# EAGLE design power_v2 (EAGLE 9.6.1)
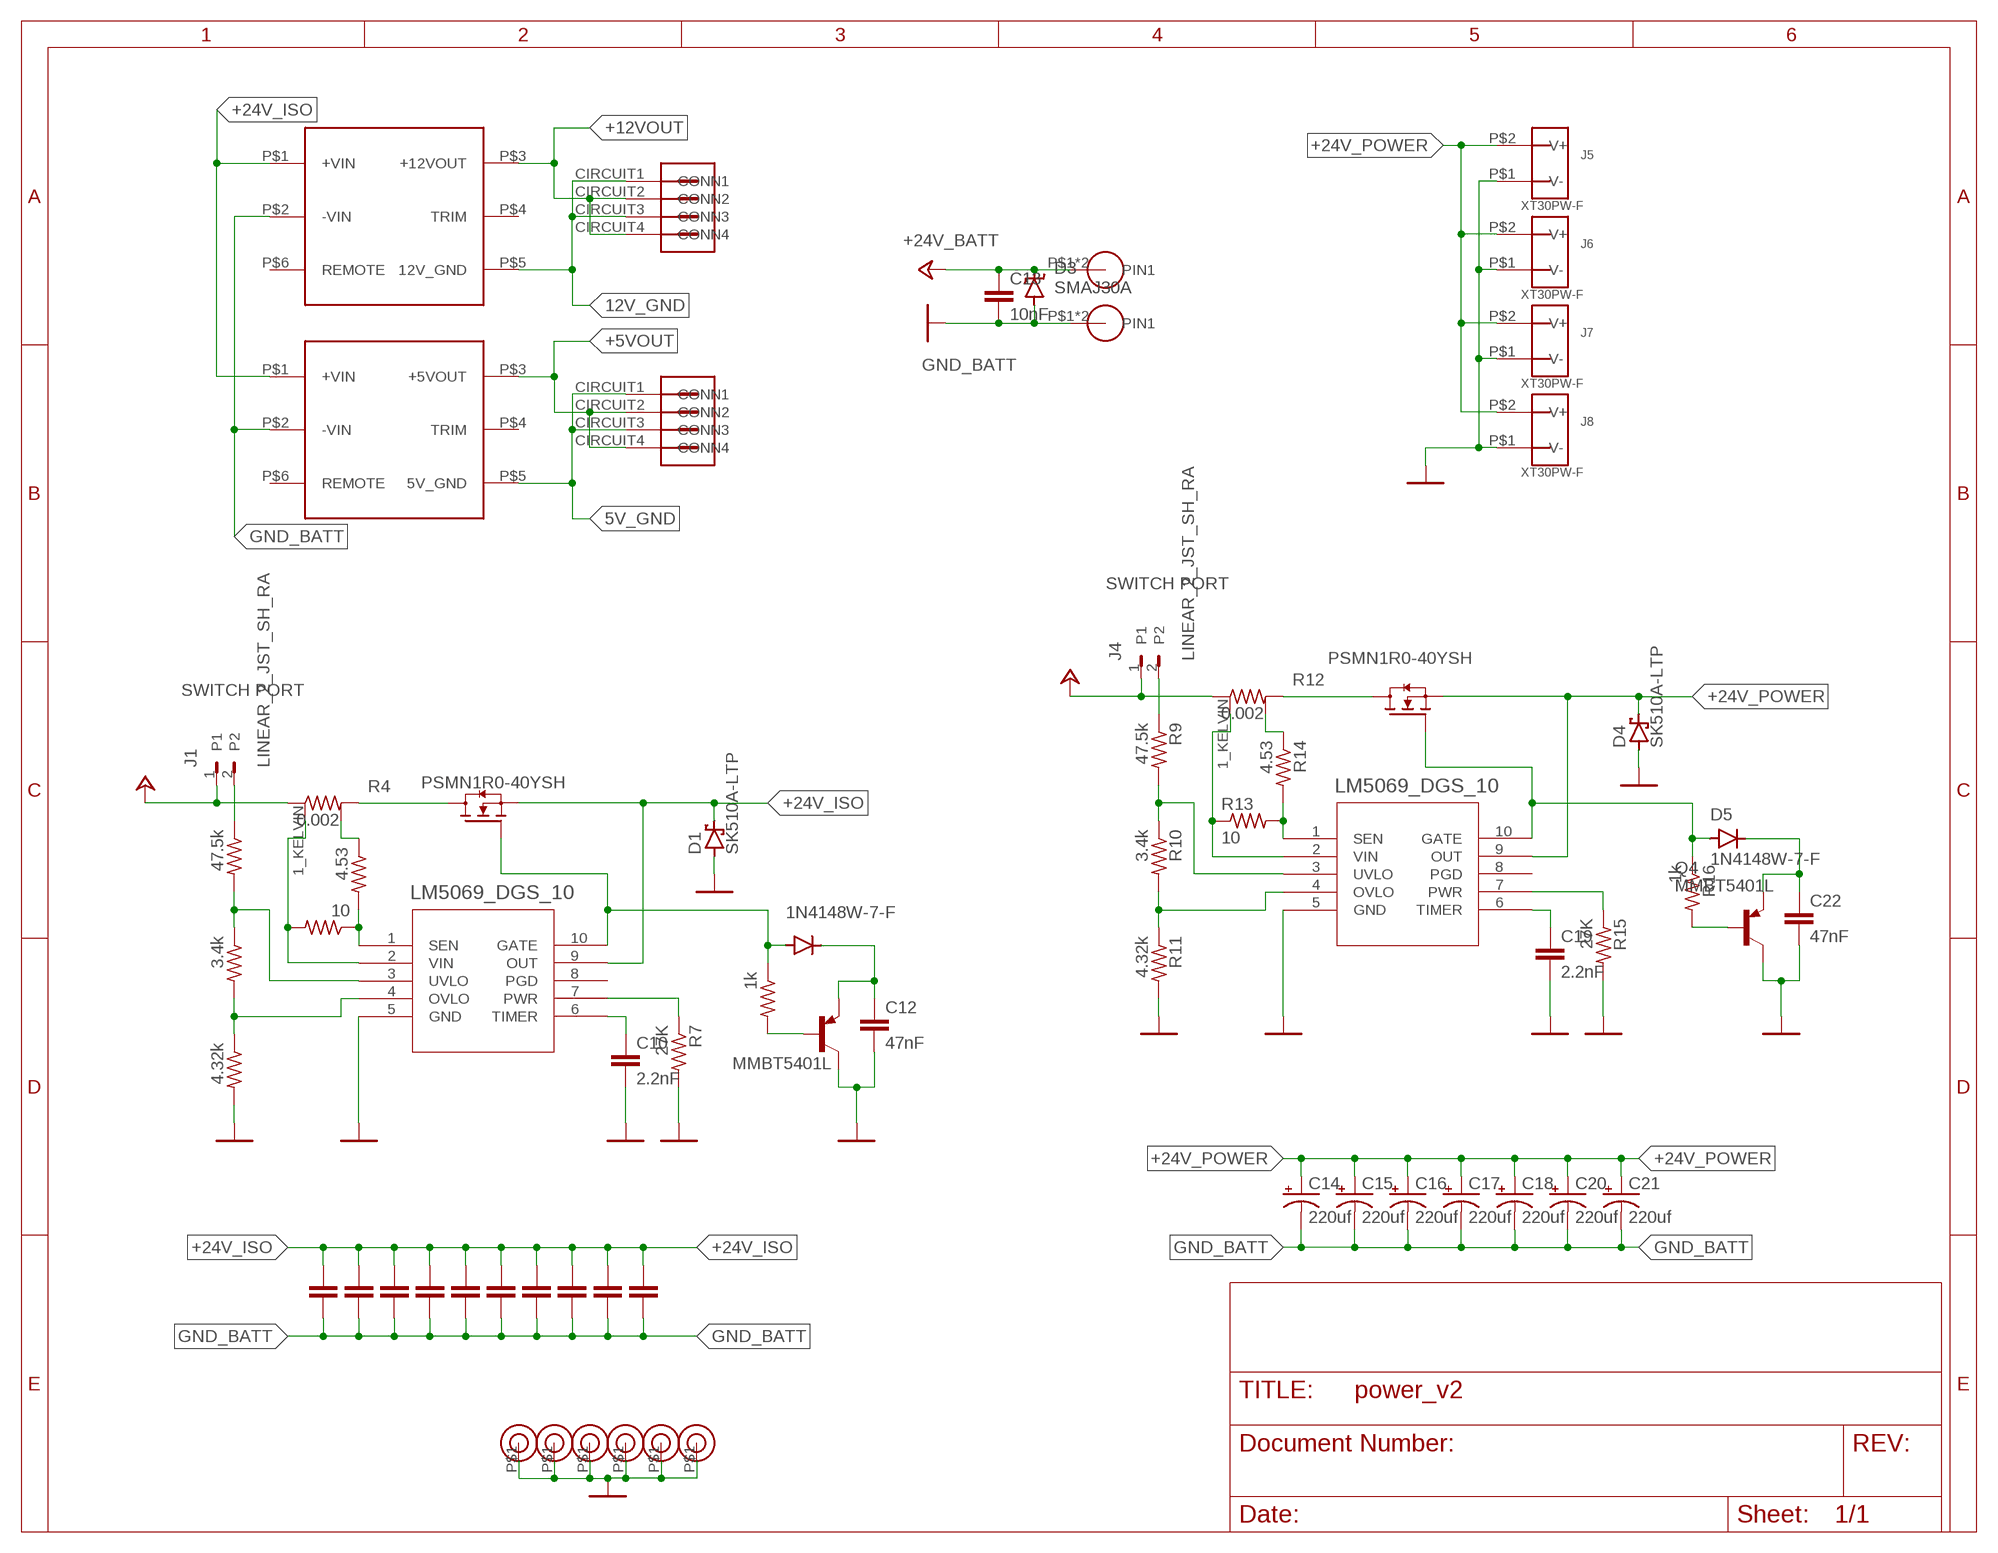
[diagram p0: schematic, sheet 1]

## Parts
C1  2.2nF  C_CERAMIC_1210  [C1210]
C2  10uF  C_CERAMIC_1210  [C1210]
C3  10uF  C_CERAMIC_1210  [C1210]
C4  10uF  C_CERAMIC_1210  [C1210]
C5  10uF  C_CERAMIC_1210  [C1210]
C6  10uF  C_CERAMIC_1210  [C1210]
C7  10uF  C_CERAMIC_1210  [C1210]
C8  10uF  C_CERAMIC_1210  [C1210]
C9  10uF  C_CERAMIC_1210  [C1210]
C10  2.2nF  C-EUC0603  [C0603]
C11  10uF  C_CERAMIC_1210  [C1210]
C12  47nF  C-EUC0603  [C0603]
C13  10nF  C-EUC0603  [C0603]
C14  220uf  35ZLH220MEFC8X11.5  [C_ELEC_8X11_5]
C15  220uf  35ZLH220MEFC8X11.5  [C_ELEC_8X11_5]
C16  220uf  35ZLH220MEFC8X11.5  [C_ELEC_8X11_5]
C17  220uf  35ZLH220MEFC8X11.5  [C_ELEC_8X11_5]
C18  220uf  35ZLH220MEFC8X11.5  [C_ELEC_8X11_5]
C19  2.2nF  C-EUC0603  [C0603]
C20  220uf  35ZLH220MEFC8X11.5  [C_ELEC_8X11_5]
C21  220uf  35ZLH220MEFC8X11.5  [C_ELEC_8X11_5]
C22  47nF  C-EUC0603  [C0603]
D1  SK510A-LTP  [DO-214AC]
D2  1N4148W-7-F  [SOD123]
D3  SMAJ30A  [DO-214AC]
D4  SK510A-LTP  [DO-214AC]
D5  1N4148W-7-F  [SOD123]
H1  GND_HOLE_M3  [HOLE_GND_M3]
H2  GND_HOLE_M3  [HOLE_GND_M3]
H3  GND_HOLE_M3  [HOLE_GND_M3]
H4  GND_HOLE_M3  [HOLE_GND_M3]
H5  GND_HOLE_M3  [HOLE_GND_M3]
H6  GND_HOLE_M3  [HOLE_GND_M3]
J1  LINEAR_2_JST_SH_RA  [JST_SM02B-SRSS-TB]
J2  12v  MOLEX_4_RA  [MOLEX_4_RA]
J3  5v  MOLEX_4_RA  [MOLEX_4_RA]
J4  LINEAR_2_JST_SH_RA  [JST_SM02B-SRSS-TB]
J5  XT30PW-F  [XT30PW-F]
J6  XT30PW-F  [XT30PW-F]
J7  XT30PW-F  [XT30PW-F]
J8  XT30PW-F  [XT30PW-F]
P1  FASTON1289_ST  [FASTON_1289-ST]
P2  FASTON1289_ST  [FASTON_1289-ST]
PS3  PDQ30-Q24-S12-D  [PDQ30-D]
PS4  PDQ30-Q24-S5-D  [PDQ30-D]
Q1  PSMN1R0-40YSH  [LFPAK56E]
Q2  MMBT5401L  [SOT23-3]
Q3  PSMN1R0-40YSH  [LFPAK56E]
Q4  MMBT5401L  [SOT23-3]
R1  47.5k  R-US_R0603  [R0603]
R2  3.4k  R-US_R0603  [R0603]
R3  4.32k  R-US_R0603  [R0603]
R4  0.002  PMR25HZPFV2L00  [R1210_KELVIN]
R5  10  R-US_R0603  [R0603]
R6  4.53  R-US_R0603  [R0603]
R7  27K  R-US_R0603  [R0603]
R8  1k  R-US_R0603  [R0603]
R9  47.5k  R-US_R0603  [R0603]
R10  3.4k  R-US_R0603  [R0603]
R11  4.32k  R-US_R0603  [R0603]
R12  0.002  PMR25HZPFV2L00  [R1210_KELVIN]
R13  10  R-US_R0603  [R0603]
R14  4.53  R-US_R0603  [R0603]
R15  27K  R-US_R0603  [R0603]
R16  1k  R-US_R0603  [R0603]
U1  LM5069_DGS_10  [VSSOP_DGS_10]
U2  LM5069_DGS_10  [VSSOP_DGS_10]

## Nets
5V_GND: J3.CIRCUIT1(CONN1) J3.CIRCUIT3(CONN3) PS4.P$5(5V_GND)
12V_GND: J2.CIRCUIT1(CONN1) J2.CIRCUIT3(CONN3) PS3.P$5(12V_GND)
+5VOUT: J3.CIRCUIT2(CONN2) J3.CIRCUIT4(CONN4) PS4.P$3(+5VOUT)
+12VOUT: J2.CIRCUIT2(CONN2) J2.CIRCUIT4(CONN4) PS3.P$3(+12VOUT)
+24V_BATT: C13.1 D3.C J1.1 J4.1 P1.P$1(PIN1) P1.P$2(PIN1) R4.1A R4.1B R12.1A R12.1B
+24V_ISO: C1.1 C2.1 C3.1 C4.1 C5.1 C6.1 C7.1 C8.1 C9.1 C11.1 D1.C PS3.P$1(+VIN) PS4.P$1(+VIN) Q1.1(S) Q1.2(S) Q1.3(S) U1.9(OUT)
+24V_POWER: C14.1(+) C15.1(+) C16.1(+) C17.1(+) C18.1(+) C20.1(+) C21.1(+) D4.C J5.P$2(V+) J6.P$2(V+) J7.P$2(V+) J8.P$2(V+) Q3.1(S) Q3.2(S) Q3.3(S) U2.9(OUT)
GND_BATT: C1.2 C2.2 C3.2 C4.2 C5.2 C6.2 C7.2 C8.2 C9.2 C10.2 C11.2 C12.2 C13.2 C14.2(-) C15.2(-) C16.2(-) C17.2(-) C18.2(-) C19.2 C20.2(-) C21.2(-) C22.2 D1.A D3.A D4.A H1.P$1(GND_HOLE) H2.P$1(GND_HOLE) H3.P$1(GND_HOLE) H4.P$1(GND_HOLE) H5.P$1(GND_HOLE) H6.P$1(GND_HOLE) J5.P$1(V-) J6.P$1(V-) J7.P$1(V-) J8.P$1(V-) P2.P$1(PIN1) P2.P$2(PIN1) PS3.P$2(-VIN) PS4.P$2(-VIN) Q2.C Q4.C R3.2 R7.2 R11.2 R15.2 U1.5(GND) U2.5(GND)
MOSFET_DRAIN: Q3.5(D) R12.2A R12.2B
MOSFET_DRAIN1: Q1.5(D) R4.2A R4.2B
N$1: R9.2 R10.1 U2.3(UVLO)
N$2: R10.2 R11.1 U2.4(OVLO)
N$3: J4.2 R9.1
N$4: R1.2 R2.1 U1.3(UVLO)
N$5: D5.A Q3.4(G) R16.1 U2.10(GATE)
N$6: R15.1 U2.7(PWR)
N$7: C19.1 U2.6(TIMER)
N$8: C22.1 D5.C Q4.E
N$9: Q4.B R16.2
N$10: R13.2 R14.2 U2.1(SEN)
N$11: R12.2_KELVIN(2K) R14.1
N$12: R2.2 R3.1 U1.4(OVLO)
N$13: J1.2 R1.1
N$14: D2.A Q1.4(G) R8.1 U1.10(GATE)
N$15: R7.1 U1.7(PWR)
N$16: C10.1 U1.6(TIMER)
N$17: C12.1 D2.C Q2.E
N$18: Q2.B R8.2
N$19: R12.1_KELVIN(1K) R13.1 U2.2(VIN)
N$20: R5.1 R6.2 U1.1(SEN)
N$21: R4.2_KELVIN(2K) R6.1
N$22: R4.1_KELVIN(1K) R5.2 U1.2(VIN)
Unconnected: J1.PAD1(GND) J1.PAD2(GND) J4.PAD1(GND) J4.PAD2(GND) PS3.P$4(TRIM) PS3.P$6(REMOTE) PS4.P$4(TRIM) PS4.P$6(REMOTE) U1.8(PGD) U2.8(PGD)

## Notes on the sheet
- SWITCH PORT
- SWITCH PORT

## Library data of the parts
C1-C9 C11 = timlib:C_CERAMIC
C10 C12 C13 C19 C22 = rcl:C-EU: CAPACITOR, European symbol; SPICEPREFIX: C
C14-C18 C20 C21 = timlib:35ZLH220MEFC8X11.5
D1 D4 = timlib:SK510A-LTP
D2 D5 = timlib:1N4148W-7-F
D3 = timlib:SMA: 12V Schottkey Datasheet <https://www.littelfuse.com/~/media/electronics/datasheets/tvs_diodes/littelfuse_tvs_diode_smaj_datasheet.pdf.pdf>
H1-H6 = timlib:GND_HOLE
J1 J4 = _T_conn:LINEAR_2
J2 J3 = timlib:MOLEX_4_RA: Molex 4 pin right angle 430450402 Datasheet <https://www.molex.com/pdm_docs/sd/430450402_sd.pdf>
J5-J8 = timlib:XT30PW-F
P1 P2 = timlib:FASTON
PS3 = timlib:PDQ30-Q24-S12-D: PDQ30-Q24-S12-D Isolated 12v DC-DC supply Datasheet <https://www.cui.com/product/resource/pdq30-d.pdf>
PS4 = timlib:PDQ30-Q24-S5-D: PDQ30-Q24-S5-D Isolated 5v DC-DC supply Datasheet <https://www.cui.com/product/resource/pdq30-d.pdf>
Q1 Q3 = timlib:PSMN1R0-40YSH: N-channel 40V 1mOhm 290A MOSFET Datasheet <https://assets.nexperia.com/documents/data-sheet/PSMN1R0-40YSH.pdf>
Q2 Q4 = timlib:MMBT5401L
R1-R3 R5-R11 R13-R16 = rcl:R-US_: RESISTOR, American symbol; SPICEPREFIX: R
R4 R12 = timlib:PMR25HZPFV
U1 U2 = timlib:LM5069_DGS_10

## Net classes
0 default: drill 0.3 mm
1 power plane: width 0.305 mm, clearance 0.5 mm

## Board
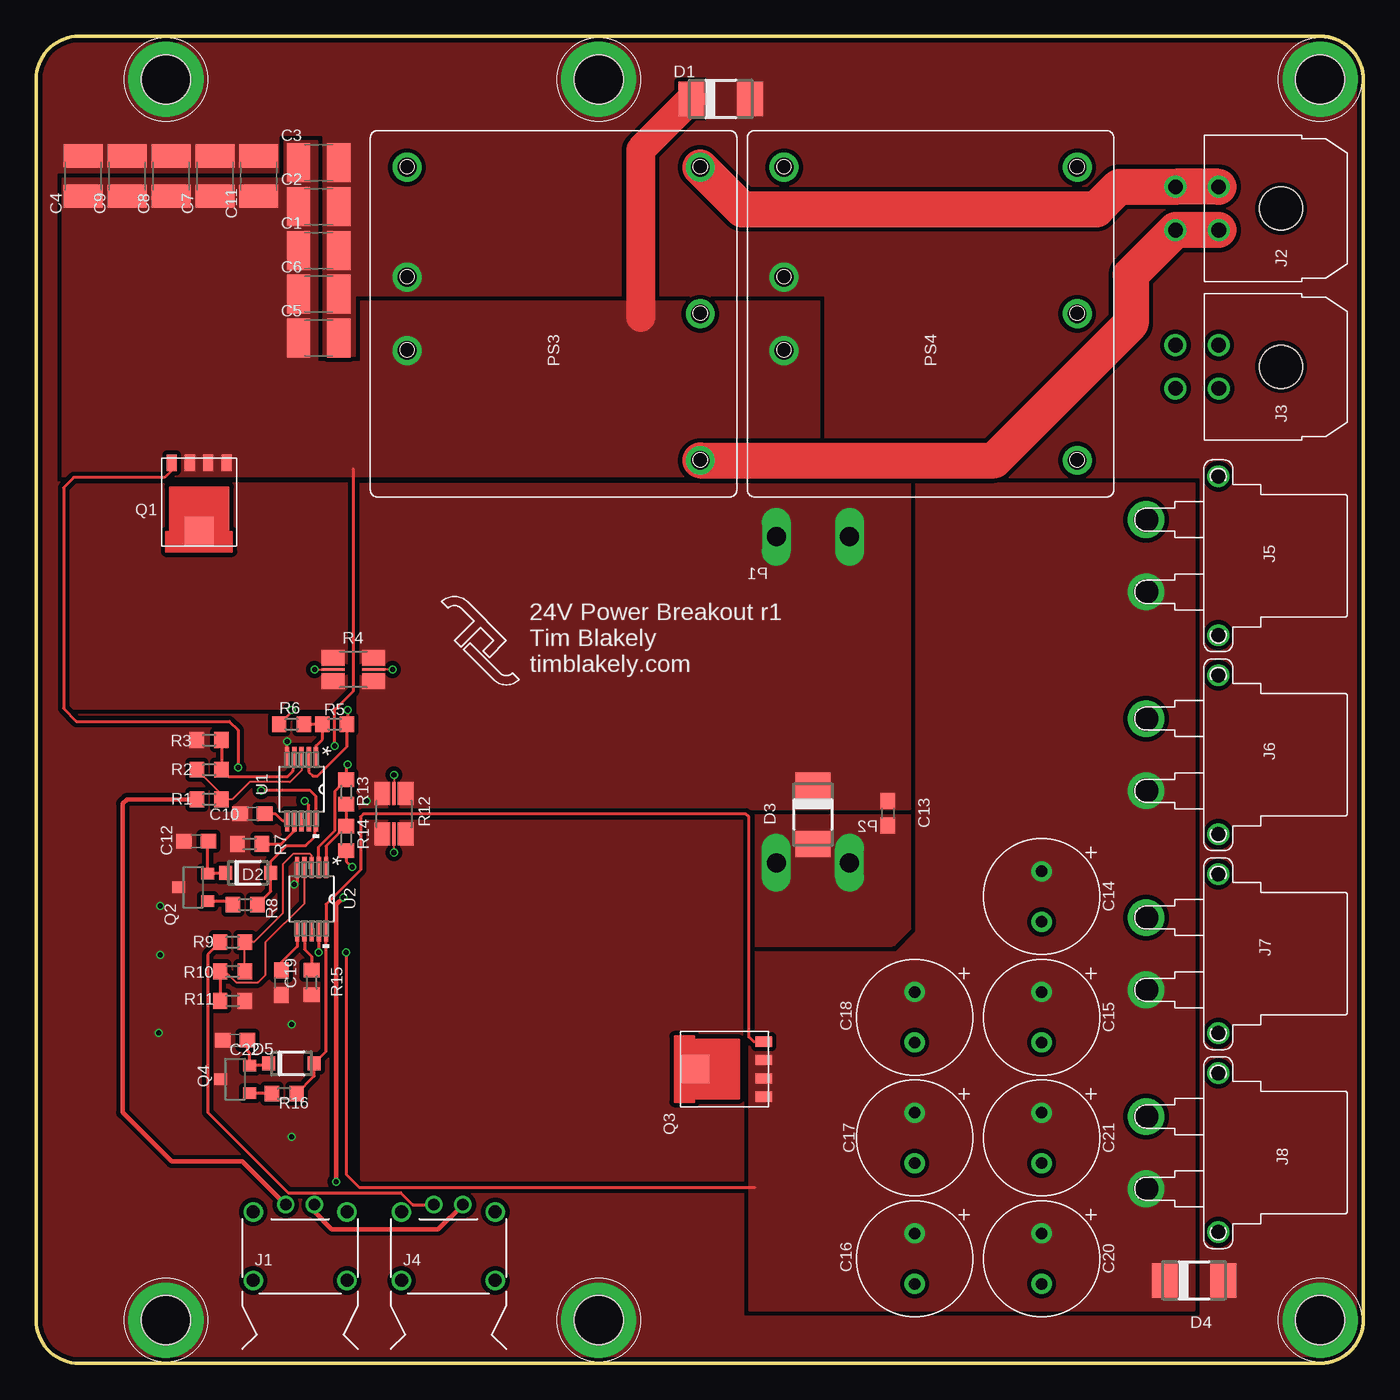
[diagram p1: board, top side]
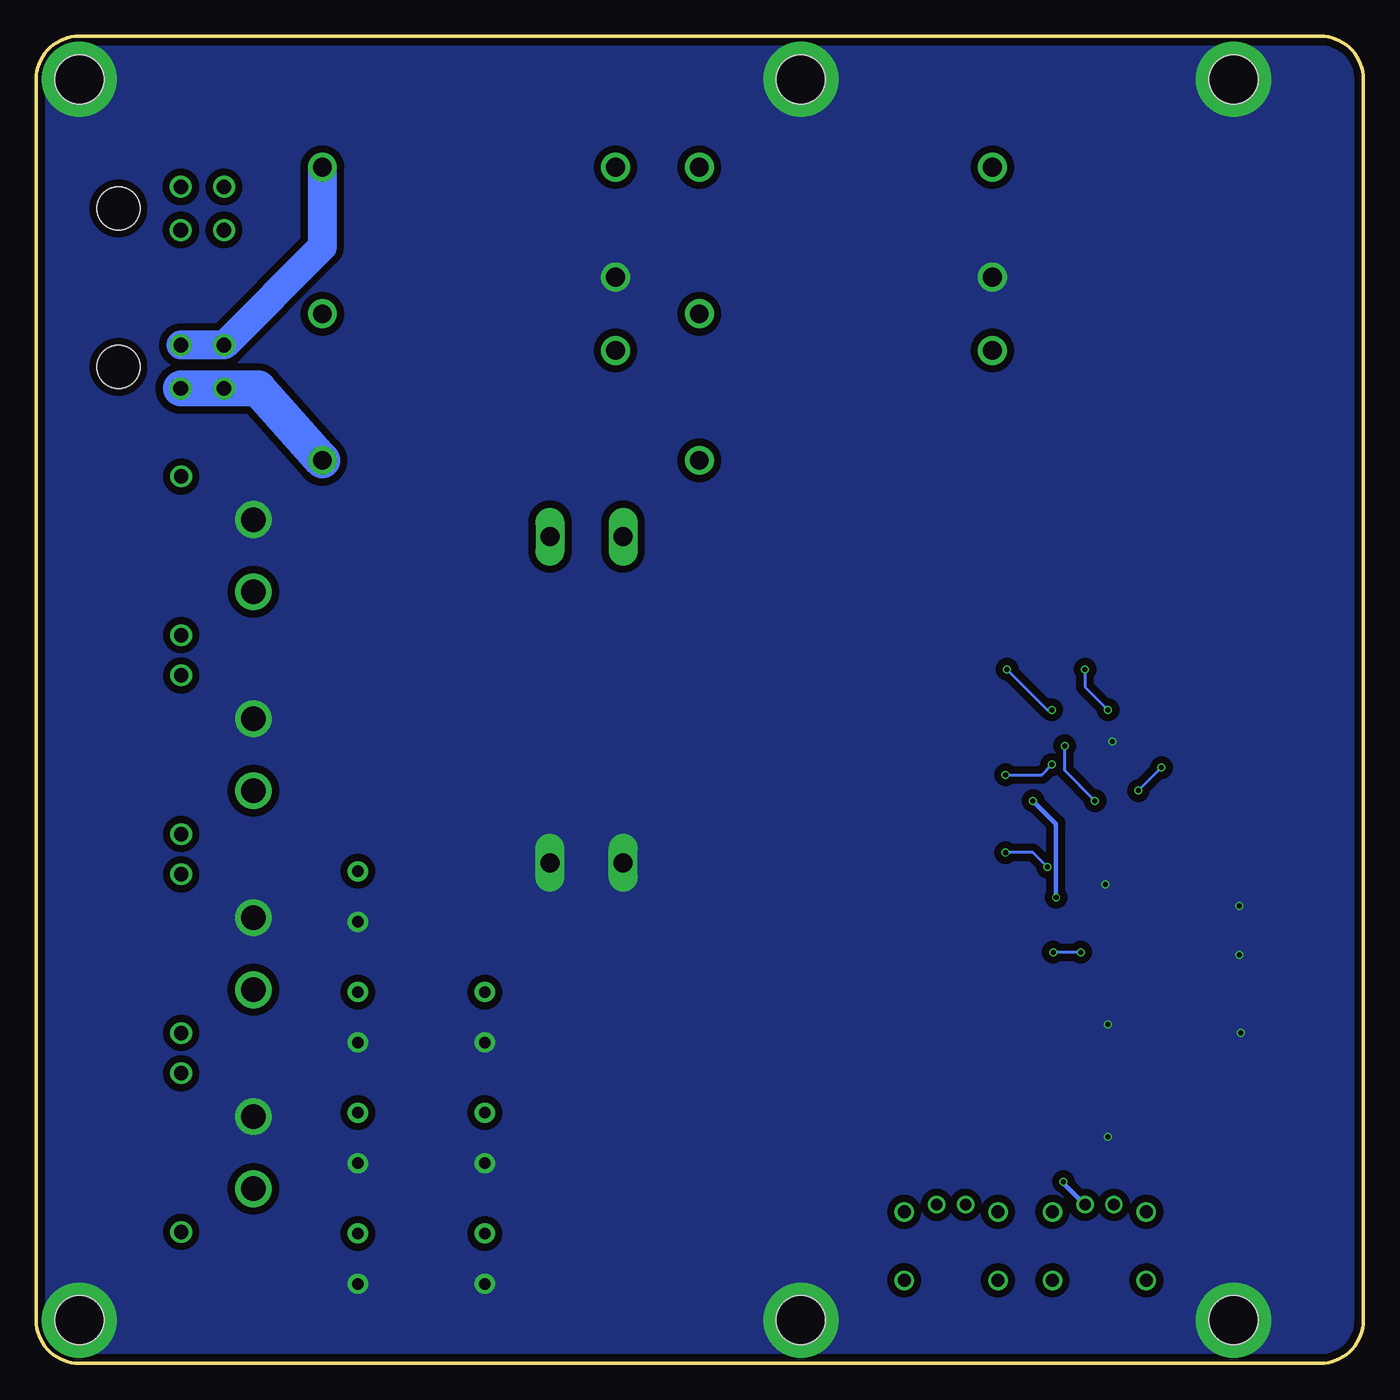
[diagram p2: board, bottom side, seen from below]

Size 92 x 92 mm. Coordinates in mm from the lower left corner, seen from the top.
Outline: 0,89 0,3 arc90 3,0 89,0 arc90 92,3 92,89 arc90 89,92 3,92 arc90 0,89
Copper layers (1*16): Top 0.035mm / dielectric 1.5mm / Bottom 0.035mm
Design rules "macrofab_2_layer": minimum track width 5mil, minimum drill 4mil, track to track 5mil, track to pad 5mil, pad to pad 5mil, via to via 5mil, smd to smd 0mil, copper to edge 10mil, drill to drill 10mil, minimum pad ring 4mil, minimum via ring 4mil, stop-mask expansion 2mil, vias tented up to drill 25mil, thermal gap 10mil
Holes 3.4 mm at 39,89 9,89 9,3 39,3 89,3 89,89

### Footprints (pad centres in the part's own frame; a part is rotated, then mirrored left to right if it is on the bottom)
C1210 = smd 1.6 x 2.7: 1 -1.4,0; 2 1.4,0
C0603 = smd 1.1 x 1: 1 -0.85,0; 2 0.85,0
C_ELEC_8X11_5 = drill 0.8 pad 1.4: 1 -1.75,0; 2 1.75,0
DO-214AC = smd 1.8 x 2.4: A 2.025,0; C -2.025,0
SOD123 = smd 0.9 x 0.95: A 1.575,0; C -1.575,0
HOLE_GND_M3 = drill 3.4 pad 5.2: P$1 0,0
M80-8420242 = drill 0.8: 1 1,0; 2 -1,0 | drill 0.9: P$4 3.25,-0.5; P$5 -3.25,-0.5; P$6 -3.25,-5.25; P$7 3.25,-5.25
MOLEX_4_RA = drill 1.016: CIRCUIT1 1.5,4.32; CIRCUIT2 -1.5,4.318; CIRCUIT3 1.5,7.32; CIRCUIT4 -1.5,7.32 | hole 3: 0,0
XT30PW-F = drill 1.7: P$1 -2.5,-5; P$2 2.5,-5 | drill 1: P$3 5.5,0; P$4 -5.5,0
FASTON_1289-ST = drill 1.32 pad 2 long: P$1 -2.54,0; P$2 2.54,0
PDQ30-D = drill 1.3 pad 2: P$1 -2.54,10.16; P$2 2.54,10.16; P$3 -10.16,-10.16; P$4 0,-10.16; P$5 10.16,-10.16; P$6 10.16,10.16
LFPAK56E = smd 0.7 x 1.15: 1 -1.905,-2.725; 2 -0.635,-2.725; 3 0.635,-2.725; 4 1.905,-2.725 | smd 2 x 2: 5 0,2.032
SOT23-3 = smd 0.8 x 0.9: B -0.95,-1; C 0,1; E 0.95,-1
R0603 = smd 1 x 1.1: 1 -0.85,0; 2 0.85,0
R1210_KELVIN = smd 1.6 x 0.229: 1_KELVIN -1.4,0; 2_KELVIN 1.4,0 | smd 1.6 x 1.1: 1A -1.4,0.8; 1B -1.4,-0.8; 2A 1.4,0.8; 2B 1.4,-0.8
VSSOP_DGS_10 = smd 1.45 x 0.3: 1 -2.2,1; 2 -2.2,0.5; 3 -2.2,0; 4 -2.2,-0.5; 5 -2.2,-1; 6 2.2,-1; 7 2.2,-0.5; 8 2.2,0; 9 2.2,0.5; 10 2.2,1

### Placement (x,y rotation side)
C1  19.59,77.14 0 top
C2  19.59,80.18 0 top
C3  19.59,83.22 0 top
C4  3.28,82.29 90 top
C5  19.59,71.06 0 top
C6  19.59,74.1 0 top
C7  12.4,82.29 90 top
C8  9.36,82.29 90 top
C9  6.32,82.29 90 top
C10  15,38.1 180 top
C11  15.44,82.29 90 top
C12  11.1,36.2 180 top
C13  59.03,38.15 270 top
C14  69.7,32.36 270 top
C15  69.7,23.99 270 top
C16  60.9,7.26 270 top
C17  60.9,15.63 270 top
C18  60.9,23.99 270 top
C19  17,26.4 270 top
C20  69.7,7.26 270 top
C21  69.7,15.63 270 top
C22  13.8,22.4 180 top
D1  47.45,87.64 0 top
D2  14.7,34 0 top
D3  53.85,38.05 270 top
D4  80.26,5.75 0 top
D5  17.7,20.8 0 top
H1  89,3 0 top
H2  39,3 0 top
H3  9,3 0 top
H4  9,89 0 top
H5  39,89 0 top
H6  89,89 0 top
J1  2-PIN  [M80-8420242]  18.3,11 0 top
J2  86.29,80.05 90 top
J3  86.29,69.08 90 top
J4  2-PIN  [M80-8420242]  28.58,11 0 top
J5  81.94,55.98 270 top
J6  81.94,42.19 270 top
J7  81.94,28.4 270 top
J8  81.94,14.61 270 top
P1  53.85,57.3 180 bottom
P2  53.85,34.7 0 bottom
PS3  35.87,72.75 90 top
PS4  62,72.75 90 top
Q1  11.3,59.7 180 top
Q2  10.9,33 90 top
Q3  47.7,20.4 90 top
Q4  13.8,19.7 90 top
R1  12,39.1 0 top
R2  12,41.15 0 top
R3  12,43.2 180 top
R4  22,48.1 180 top
R5  20.7,44.3 0 top
R6  17.7,44.3 0 top
R7  14.8,36 180 top
R8  14.5,31.8 180 top
R9  13.61,29.2 0 top
R10  13.61,27.17 180 top
R11  13.61,25.13 0 top
R12  24.8,38.1 270 top
R13  21.5,39.6 270 top
R14  21.5,36.4 90 top
R15  19.1,26.41 270 top
R16  17.21,18.7 180 top
U1  18.4,39.8 270 top
U2  19.1,32.19 270 top

### Tracks (layer width: path | path; a pad name or v marks a point on that pad's centre or on a via)
5V_GND
  Bottom 2: PS4.P$5 72.16,77.39 J3.CIRCUIT3 J3.CIRCUIT1
12V_GND
  Top 2.5: J2.CIRCUIT1 J2.CIRCUIT3 75.05,81.55 73.5,80 48.94,80 PS3.P$5
+5VOUT
  Bottom 2.5: PS4.P$3 76.59,67.58 J3.CIRCUIT4 J3.CIRCUIT2
+12VOUT
  Top 2.5: PS3.P$3 66.39,62.59 75.87,72.07 75.87,75.45 J2.CIRCUIT4 J2.CIRCUIT2
+24V_BATT  (via drill 0.35)
  Top 0.3: J4.1 27.88,9.3 20.5,9.3 19.3,10.5 J1.1 | v21.3,32.3 20.8,31.8 v20.8,12.6
  Bottom 0.3: J1.1 20.8,12.5 v20.8,12.6 | v21.3,32.3 21.3,37.4 v22.9,39
  pour Top (isolate 0.3, rank 2, no thermals): 60.6,61 60.6,38.4 22.3,38.4 22.3,61
+24V_ISO  (via drill 0.35)
  Top 0.2: U1.9 18.9,38.7 v18.6,39 | v20.7,42.8 20.7,45.3 22,46.6 22,62
  Top 2: D1.C 41.9,84.11 41.9,72.5
  Bottom 0.2: v18.6,39 20.7,41.1 v20.7,42.8
  pour Top (isolate 0.3, no thermals): 1.8,61.5 54.3,61.5 54.3,73.6 22.5,73.6 22.5,69.4 19.5,69.4 19.5,84.7 17.2,84.7 17.2,82.1 1.8,82.1
+24V_POWER  (via drill 0.35)
  Top 0.2: U2.9 v19.6,28.5 | v21.5,28.5 21.5,13.1 22.4,12.2 49.8,12.2
  Bottom 0.2: v19.6,28.5 v21.5,28.5
  pour Top (isolate 0.3, no thermals): 49.4,3.7 80.3,3.7 80.3,61 61,61 61,29.9 59.6,28.5 49.4,28.5
GND_BATT  (via drill 0.35)
  Top 0.2: U2.5 18.1,33.4 v17.9,33.2 | U1.5 v17.4,43.1
  other vias: 8.6,31.7 8.6,28.3 8.5,22.9 17.7,23.5 17.7,15.7
  pour Bottom (isolate 0.5, no thermals): -0.6,92.6 92.6,92.6 92.6,-0.3 -0.6,-0.3
  pour Top (isolate 0.3, rank 4, no thermals): -0.5,92.6 92.5,92.6 92.5,-0.2 -0.5,-0.2
  pour Top (isolate 0.3, no thermals): 49.4,29 59.5,29 60.6,30.1 60.6,37.8 49.4,37.8
MOSFET_DRAIN
  pour Top (isolate 0.3, rank 3, no thermals): 49.1,12.6 49.1,37.8 22.5,37.8 22.5,12.6
MOSFET_DRAIN1
  pour Top (isolate 0.3, no thermals): 1.9,61 1.9,45.4 21.7,45.4 21.7,61
N$1
  Top 0.152: U2.3 19.1,35.2 18.98,35.32 17.82,35.32 17.1,34.6 17.1,31.2 15.1,29.2 R9.2 R10.1
N$2
  Top 0.152: R10.2 13.12,27.17 13.88,26.41 15.39,26.41 15.9,26.93 15.9,29.2 18.6,31.9 U2.4
  Top 0.2: R10.2 R11.1
N$3
  Top 0.2: R9.1 11.9,28.34 11.9,17.4 17.47,11.83 25.28,11.83 26.11,11 J4.2
N$4
  Top 0.152: R2.1 12.85,39.45 R1.2 13.6,39.1 14.8,40.3 17.6,40.3 18.4,41.1 U1.3
N$5
  Top 0.2: R16.1 19.27,19.91 D5.A 20.1,21.62 U2.10 20.1,31.82 22.48,34.2 22.48,37.88 22.7,38.1 49.2,38.1 49.4,37.9 49.4,22.63 49.73,22.3 Q3.4
N$6
  Top 0.2: U2.7 18.6,28.7 19.1,28.2 R15.1
N$7
  Top 0.2: U2.6 18.1,28.9 17,27.8 C19.1
N$8
  Top 0.2: D5.C 15.97,20.65 Q4.E 14.8,21.5 14.65,21.65 C22.1
N$9
  Top 0.2: Q4.B 16.31,18.75 R16.2
N$10
  Top 0.2: U2.1 20.1,35.85 R14.2 R13.2
N$11  (via drill 0.35)
  Top 0.152: v24.8,35.4 R12.2_KELVIN
  Top 0.2: R14.1 21.5,34.8 v21.9,34.4
  Bottom 0.2: v21.9,34.4 22.9,35.4 v24.8,35.4
N$12
  Top 0.2: R3.1 R2.2 13.35,40.65 17.41,40.65 17.8,41.04 U1.4
N$13
  Top 0.3: R1.1 6.3,39.1 6,38.8 6,17.4 9.4,14 14.3,14 J1.2
N$14  (via drill 0.35)
  Top 0.2: R8.1 16.27,32.73 D2.A 16.27,34.8 17.38,35.9 18.7,35.9 19.3,36.5 U1.10 19.4,39.3 19,39.7 v15.6,39.7 | Q1.4 9.39,61.9 8.9,61.4 2.6,61.4 1.9,60.7 1.9,45.4 2.8,44.5 13.4,44.5 14,43.9 v14,41.3
  Bottom 0.2: v15.6,39.7 v14,41.3
N$15
  Top 0.2: U1.7 17.9,36.9 17,36 R7.1
N$16
  Top 0.2: U1.6 17.1,37.6 16.6,38.1 C10.1
N$17
  Top 0.2: D2.C 11.95,34 Q2.E 11.9,36.15 C12.1
N$18
  Top 0.2: Q2.B 13.4,32.05 R8.2
N$19  (via drill 0.35)
  Top 0.152: v24.8,40.8 R12.1_KELVIN
  Top 0.2: v21.6,41.5 21.5,41.4 R13.1 20.72,39.67 20.72,36.94 19.6,35.81 U2.2
  Bottom 0.2: v24.8,40.8 22.3,40.8 v21.6,41.5
N$20
  Top 0.2: U1.1 19.4,42.8 19.85,43.25 R5.1 R6.2
N$21  (via drill 0.35)
  Top 0.152: v19.3,48.1 R4.2_KELVIN
  Top 0.2: v17.7,45.3 17.7,45.15 R6.1
  Bottom 0.2: v19.3,48.1 19.3,46.9 v17.7,45.3
N$22  (via drill 0.35)
  Top 0.152: v24.7,48.1 R4.1_KELVIN
  Top 0.2: v21.6,45.3 21.6,44.35 R5.2 21.55,42.75 19.5,40.7 19.2,40.7 18.9,41 U1.2
  Bottom 0.2: v24.7,48.1 21.9,45.3 v21.6,45.3

### Text on the board
tPlace: 24V Power Breakout r1 / Tim Blakely / timblakely.com